# Altium project PMT_simulator.PrjPCB (part 3 of 3)

## Sheet Supply_DAC.SchDoc: =TopTitle
size 420 x 297 mm; EDA_Number: ARTIQ; Projet: Zotino; CheckedBy: -; Author: G.Kasprowicz; CompanyName: WUT ISE; DrawnBy: G.Kasprowicz; Organization: WUT ISE; Address1: PW ISE; Address2: Nowowiejska 15/19 00-665 Warsaw; Address3: gkasprow@gmail.com; Revision: 1.0.1; SheetNumber: -; SheetTotal: -; ModifiedBy: -; CheckedDate: -; Title2: Supply DAC; DivGrp: WUT ISE; Designer: G.Kasprowicz; ModifiedDate: -; ProjectName: Sensor Box
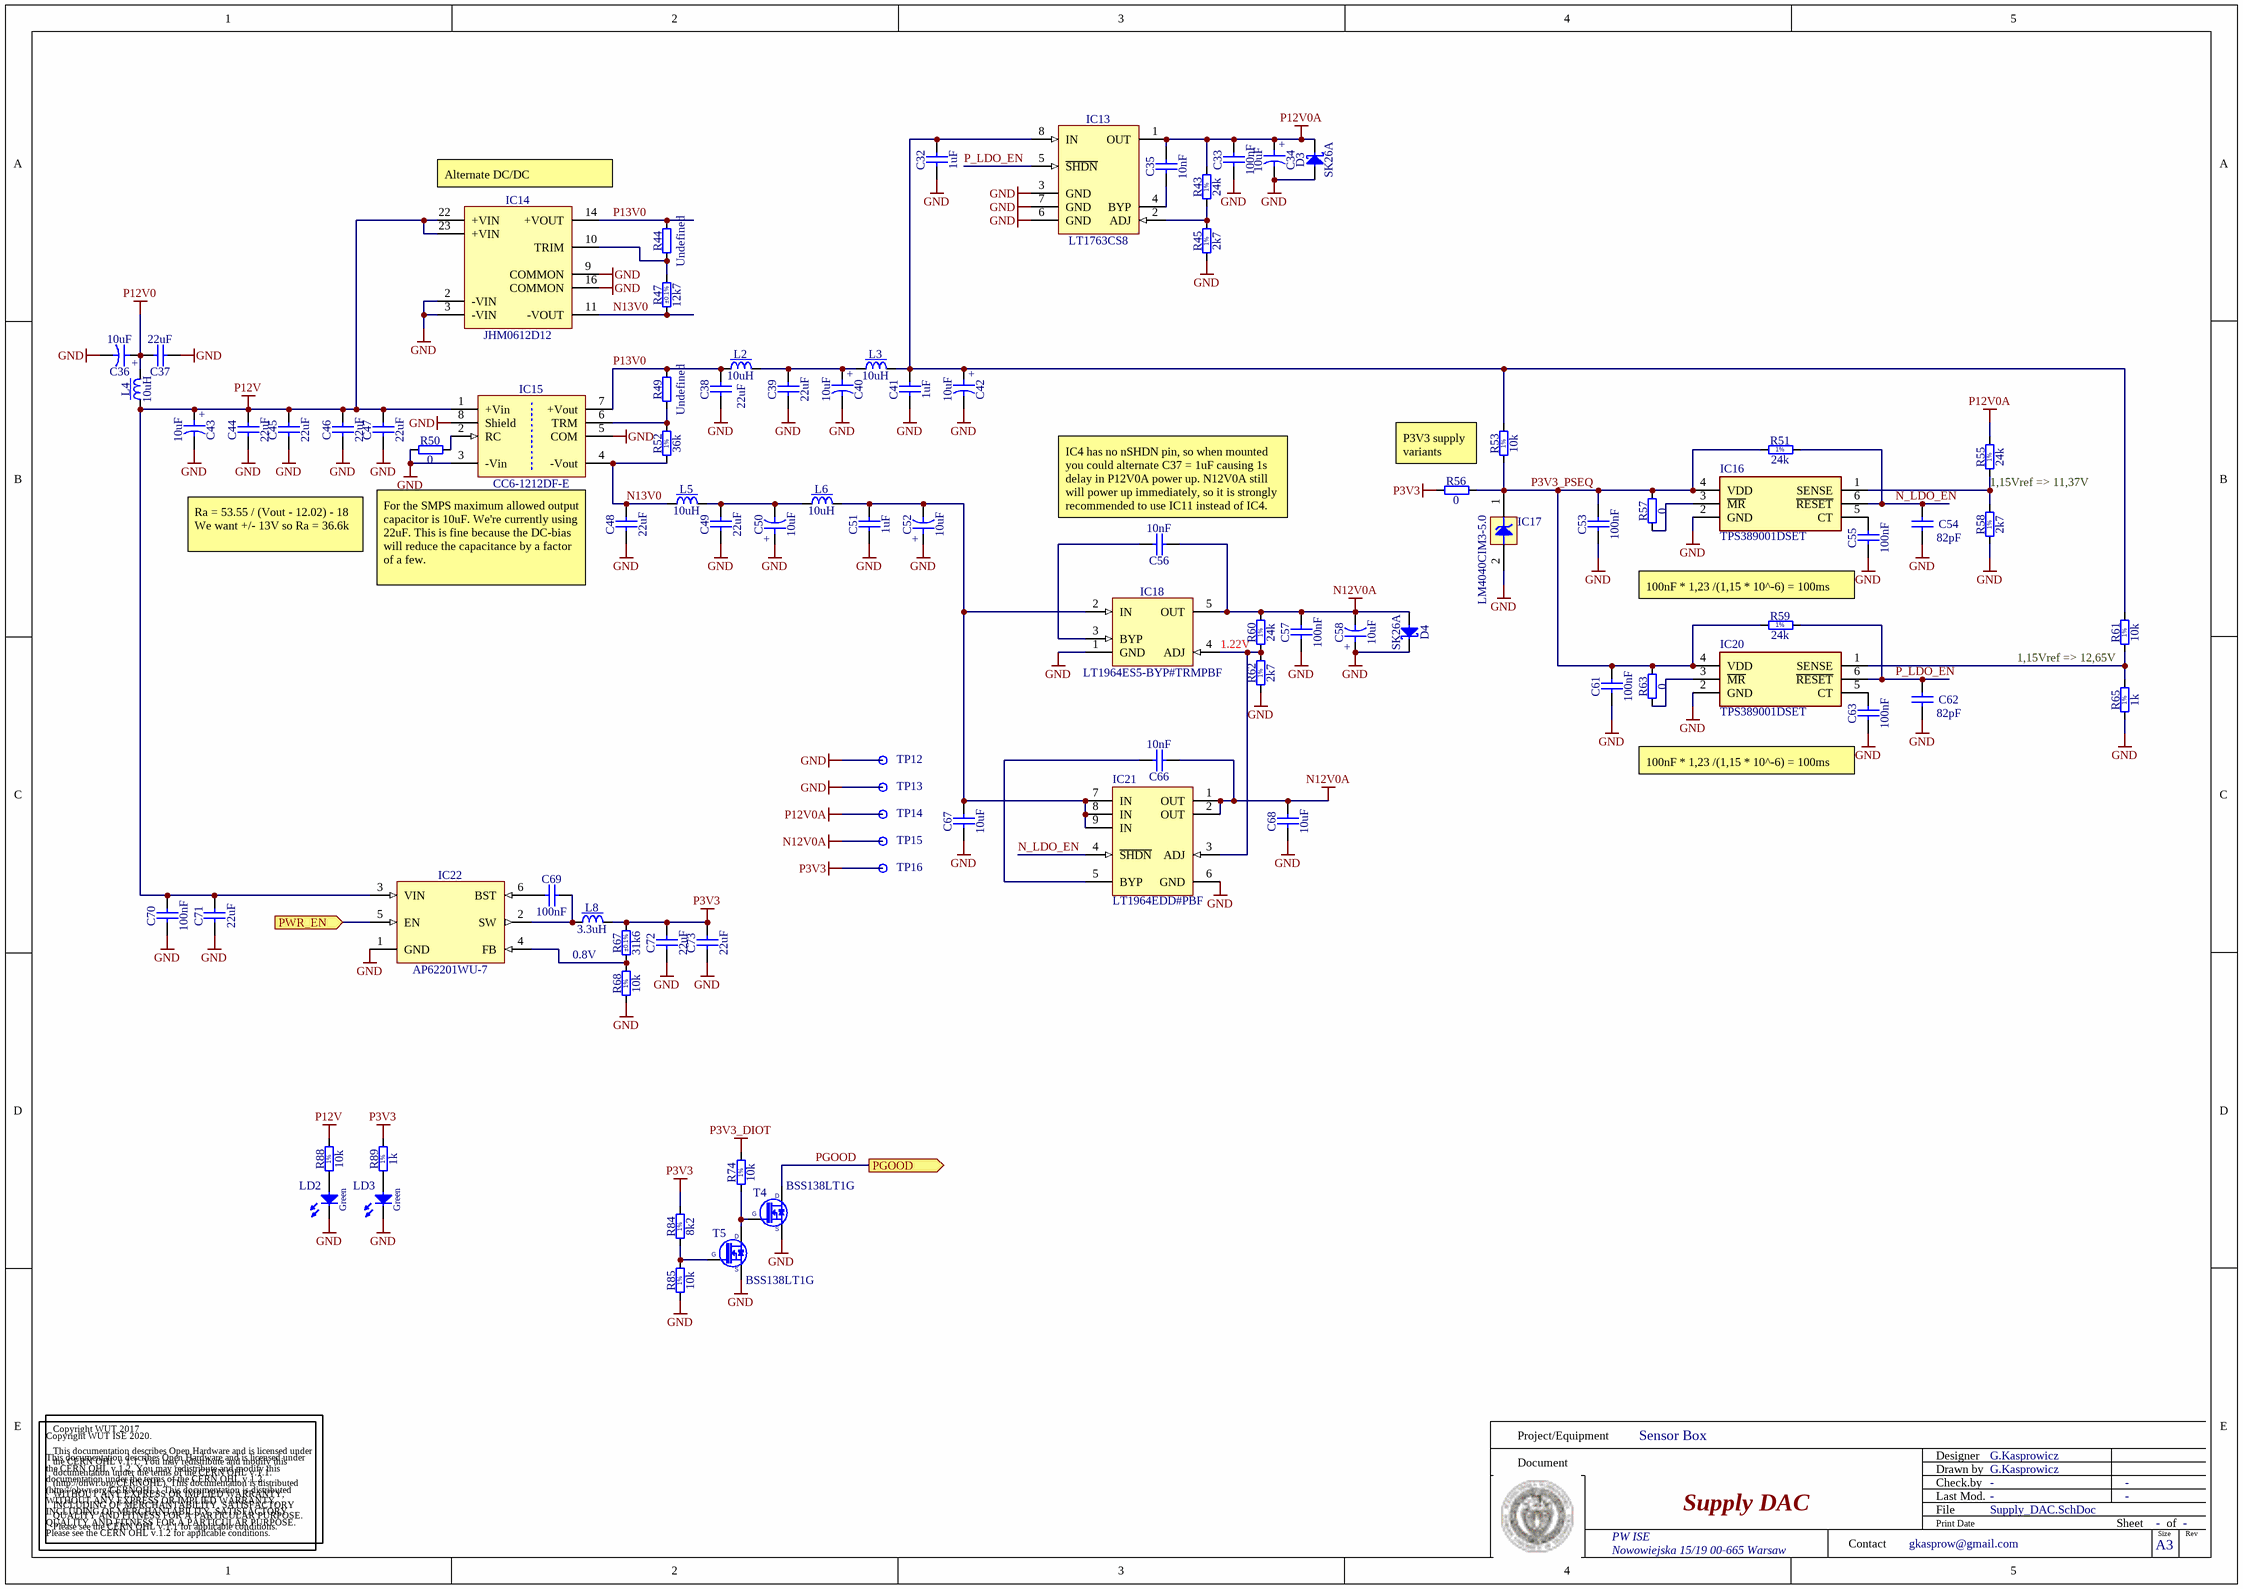
[diagram p6: Supply_DAC.SchDoc]

### Parts
C32  1uF  [CAPC1608X87N]
C33  100nF  [CAPC1005X55N]
C34  10uF  [CAPMP3216X180N]
C35  10nF  [CAPC1608X87N]
C36  10uF  [CAPMP3216X180N]
C37  22uF  [CAPC2012X135N]
C38  22uF  [CAPC2012X135N]
C39  22uF  [CAPC2012X135N]
C40  10uF  [CAPMP3216X180N]
C41  1uF  [CAPC1608X87N]
C42  10uF  [CAPMP3216X180N]
C43  10uF  [CAPMP3216X180N]
C44  22uF  [CAPC2012X135N]
C45  22uF  [CAPC2012X135N]
C46  22uF  [CAPC2012X135N]
C47  22uF  [CAPC2012X135N]
C48  22uF  [CAPC2012X135N]
C49  22uF  [CAPC2012X135N]
C50  10uF  [CAPMP3216X180N]
C51  1uF  [CAPC1608X87N]
C52  10uF  [CAPMP3216X180N]
C53  100nF  [CAPC1005X55N]
C54  82pF  [CAPC1608X87N]
C55  100nF  [CAPC1005X55N]
C56  10nF  [CAPC1608X87N]
C57  100nF  [CAPC1005X55N]
C58  10uF  [CAPMP3216X180N]
C61  100nF  [CAPC1005X55N]
C62  82pF  [CAPC1608X87N]
C63  100nF  [CAPC1005X55N]
C66  10nF  [CAPC1608X87N]
C67  10uF  [CAPC1608X80N]
C68  10uF  [CAPC1608X80N]
C69  100nF  [CAPC1005X55N]
C70  100nF  [CAPC1005X55N]
C71  22uF  [CAPC2012X135N]
C72  22uF  [CAPC2012X135N]
C73  22uF  [CAPC2012X135N]
D3  SK26A  [DIOM5126X265N]
D4  SK26A  [DIOM5126X265N]
IC13  LT1763CS8  [SOIC127P600X175-8N]
IC14  JHM0612D12  [DCDC_XPPOWER_JHM0X]
IC15  CC6-1212DF-E  [CC6-1212DF-E]
IC16  TPS389001DSET  [TPS610985DSET]
IC17  LM4040CIM3-5.0  [SOT95P237X112-3N]
IC18  LT1964ES5-BYP#TRMPBF  [SOT95P280X100-5N]
IC20  TPS389001DSET  [TPS610985DSET]
IC21  LT1964EDD#PBF  [LT-DD-8_V]
IC22  AP62201WU-7  [SOT95P280X100-6N]
L2  10uH  [IND_MURATA-PS_8400]
L3  10uH  [IND_MURATA-PS_8400]
L4  10uH  [IND_MURATA-PS_8400]
L5  10uH  [IND_MURATA-PS_8400]
L6  10uH  [IND_MURATA-PS_8400]
L8  3.3uH  [IND_WURTH_WE-TPC_4828]
LD2  Green  [LED_KINGBRIGHT_KPH-1608CGCK]
LD3  Green  [LED_KINGBRIGHT_KPH-1608CGCK]
R43  24k  [RESC1608X55N]
R44  Undefined  [RESC1608X55N]
R45  2k7  [RESC1608X55N]
R47  12k7  Tolerance: ±0.1%  [RESC1608X55N]
R49  Undefined  [RESC1608X55N]
R50  0  [RESC1005X40N]
R51  24k  [RESC1608X55N]
R52  36k  [RESC1608X55N]
R53  10k  [RESC1005X40N]
R55  24k  [RESC1608X55N]
R56  0  [RESC1005X40N]
R57  0  [RESC1005X40N]
R58  2k7  [RESC1608X55N]
R59  24k  [RESC1608X55N]
R60  24k  [RESC1608X55N]
R61  10k  [RESC1005X40N]
R62  2k7  [RESC1608X55N]
R63  0  [RESC1005X40N]
R65  1k  [RESC1608X55N]
R67  31k6  Tolerance: ±0.1%  [RESC1005X35N]
R68  10k  [RESC1005X40N]
R74  10k  [RESC1005X40N]
R84  8k2  [RESC1005X40N]
R85  10k  [RESC1005X40N]
R88  10k  [RESC1005X40N]
R89  1k  [RESC1005X40N]
T4  BSS138LT1G  [SOT95P240X110-3N]
T5  BSS138LT1G  [SOT95P240X110-3N]
TP12  Test Point  [TPS127]  (value not drawn)  (no BOM)
TP13  Test Point  [TPS127]  (value not drawn)  (no BOM)
TP14  Test Point  [TPS127]  (value not drawn)  (no BOM)
TP15  Test Point  [TPS127]  (value not drawn)  (no BOM)
TP16  Test Point  [TPS127]  (value not drawn)  (no BOM)

### Ports
PGOOD (out), PWR_EN (in)

### Nets
GND: C32.1 C33.1 C34.2 C36.2 C37.1 C38.1 C39.1 C40.2 C41.1 C42.2 C43.2 C44.1 C45.1 C46.1 C47.1 C48.1 C49.1 C50.1 C51.1 C52.1 C53.1 C54.1 C55.1 C57.1 C58.1 C61.1 C62.1 C63.1 C67.1 C68.1 C70.1 C71.1 C72.1 C73.1 D3.2(A) D4.1(C) IC13.3(GND) IC13.6(GND) IC13.7(GND) IC14.2(-VIN) IC14.3(-VIN) IC14.9(COMMON) IC14.16(COMMON) IC15.3(-Vin) IC15.5(COM) IC15.8(Shield) IC16.2(GND) IC17.2(A) IC18.1(GND) IC20.2(GND) IC21.6(GND) IC22.1(GND) LD2.1(C) LD3.1(C) R45.1 R50.1 R58.1 R62.1 R65.1 R68.1 R85.1 T4.2(S) T5.2(S) TP12.1 TP13.1
N12V0A: C56.1 C57.2 C58.2 C66.1 C68.2 D4.2(A) IC18.5(OUT) IC21.1(OUT) IC21.2(OUT) R60.2 TP15.1
P3V3: C72.2 C73.2 L8.2 R56.1 R67.2 R84.2 R89.2 TP16.1
P3V3_DIOT: R74.2
P12V: C43.1 C44.2 C45.2 C46.2 C47.2 C70.2 C71.2 IC14.22(+VIN) IC14.23(+VIN) IC15.1(+Vin) IC22.3(VIN) L4.1 R88.2
P12V0: C36.1 C37.2 L4.2
P12V0A: C33.2 C34.1 C35.2 D3.1(C) IC13.1(OUT) R43.2 R55.2 TP14.1
N13V0: C48.2 IC14.11(-VOUT) IC15.4(-Vout) L5.1 R47.1 R52.1
N_LDO_EN: C54.2 IC16.6(~{RESET}) IC21.4(~{SHDN}) R51.2
P3V3_PSEQ: C53.2 C61.2 IC16.4(VDD) IC17.1(C) IC20.4(VDD) R51.1 R53.1 R56.2 R57.2 R59.1 R63.2
P13V0: C38.2 IC14.14(+VOUT) IC15.7(+Vout) L2.1 R44.2 R49.2
P_LDO_EN: C62.2 IC13.5(~{SHDN}) IC20.6(~{RESET}) R59.2
PGOOD: T4.3(D) ; port PGOOD
NetC32_2: C32.2 C41.2 C42.1 IC13.8(IN) L3.2 R53.2 R61.2
NetC35_1: C35.1 IC13.4(BYP)
NetC39_2: C39.2 C40.1 L2.2 L3.1
NetC49_2: C49.2 C50.2 L5.2 L6.1
NetC51_2: C51.2 C52.2 C67.2 IC18.2(IN) IC21.7(IN) IC21.8(IN) IC21.9(IN) L6.2
NetC55_2: C55.2 IC16.5(CT)
NetC56_2: C56.2 IC18.3(BYP)
NetC63_2: C63.2 IC20.5(CT)
NetC66_2: C66.2 IC21.5(BYP)
NetC69_1: C69.1 IC22.6(BST)
NetC69_2: C69.2 IC22.2(SW) L8.1
NetIC13_2: IC13.2(ADJ) R43.1 R45.2
NetIC14_10: IC14.10(TRIM) R44.1 R47.2
NetIC15_2: IC15.2(RC) R50.2
NetIC15_6: IC15.6(TRM) R49.1 R52.2
NetIC16_1: IC16.1(SENSE) R55.1 R58.2
NetIC16_3: IC16.3(~{MR}) R57.1
NetIC18_4: IC18.4(ADJ) IC21.3(ADJ) R60.1 R62.2
NetIC20_1: IC20.1(SENSE) R61.1 R65.2
NetIC20_3: IC20.3(~{MR}) R63.1
NetIC22_4: IC22.4(FB) R67.1 R68.2
NetIC22_5: IC22.5(EN) ; port PWR_EN
NetLD2_2: LD2.2(A) R88.1
NetLD3_2: LD3.2(A) R89.1
NetR74_1: R74.1 T4.1(G) T5.3(D)
NetR84_1: R84.1 R85.2 T5.1(G)

### Notes on the sheet
- (near IC14) Alternate DC/DC
  Trim +10%, R27=12.8k
- P3V3 supply
  variants
- (near C56) IC4 has no nSHDN pin, so when mounted you could alternate C37 = 1uF causing 1s delay in P12V0A power up. N12V0A still will power up immediately, so it is strongly recommended to use IC11 instead of IC4.
- (near R55) 1,15Vref => 11,37V
- Ra = 53.55 / (Vout - 12.02) - 18
  We want +/- 13V so Ra = 36.6k
- For the SMPS maximum allowed output capacitor is 10uF. We're currently using 22uF. This is fine because the DC-bias will reduce the capacitance by a factor of a few.
- 100nF * 1,23 /(1,15 * 10^-6) = 100ms
- 1.22V
- (near R61) 1,15Vref => 12,65V
- 0.8V
- Copyright WUT 2017
  This documentation describes Open Hardware and is licensed under the CERN OHL v.1.1. You may redistribute and modify this documentation under the terms of the CERN OHL v.1.1. (http://ohwr.org/CERNOHL). This documentation is distributed WITHOUT ANY EXPRESS OR IMPLIED WARRANTY, INCLUDING OF MERCHANTABILITY, SATISFACTORY QUALITY AND FITNESS FOR A PARTICULAR PURPOSE. Please see the CERN OHL v.1.1 for applicable conditions.
- Project/Equipment
- Document
- Designer
- Drawn by
- Check.by
- Copyright WUT ISE 2020.
  This documentation describes Open Hardware and is licensed under the CERN OHL v.1.2. You may redistribute and modify this documentation under the terms of the CERN OHL v.1.2. (http://ohwr.org/CERNOHL). This documentation is distributed WITHOUT ANY EXPRESS OR IMPLIED WARRANTY, INCLUDING OF MERCHANTABILITY, SATISFACTORY QUALITY AND FITNESS FOR A PARTICULAR PURPOSE. Please see the CERN OHL v.1.2 for applicable conditions.
- Contact
- File
- Last Mod.
- Print Date
- Sheet
- Size
- A3
- of
- Rev
- (in symbol CTE3216-18_10UF_16V_20%_AVX_TCJ) +
- (in symbol R0402_1K_1%_0.0625W_100PPM) 1%
- (in symbol R0402_8K2_1%_0.0625W_100PPM) 1%
- (in symbol R0402_10K_1%_0.0625W_100PPM) 1%
- (in symbol R0603_1K_1%_0.1W_100PPM) 1%
- (in symbol R0603_2K7_1%_0.1W_100PPM) 1%
- (in symbol R0603_24K_1%_0.1W_100PPM) 1%
- (in symbol R0603_36K_1%_0.1W_100PPM) 1%

### Library data of the parts
C32 C41 C51 = CC0603_1UF_25V_10%_X7R: Non-polarised capacitor; Part Description: SMD Multilayer Chip Ceramic Capacitor; Manufacturer: GENERIC; Manufacturer1 Part Number: GRM188R71E105KA12D; Voltage: 25V; TC: X7R; Tolerance: ±10%; Part Number: CC0603_1UF_25V_10%_X7R; Component Kind: Standard; Component Type: Standard; Pin Count: 2; Value: 1uF; Status: None; Manufacturer Part Number: CC0603_1UF_25V_10%_X7R; Case: 0603; Mounted: Yes; Socket: No; SMD: Yes; Sense: No; Manufacturer1 Example: MURATA; Manufacturer1 ComponentHeight: 0.9mm; HelpURL: \\cern.ch\dfs\Applications\Altium\Datasheets\CC0603_X7R_MURATA.pdf; Author: CERN DEM JLC; CreateDate: 18.01.2011; LatestRevisionDate: 18.01.2011
C33 C53 C55 C57 C61 C63 C69 C70 = CC0402_100NF_16V_10%_X5R: Non-polarised capacitor; Part Description: SMD Multilayer Chip Ceramic Capacitor; Manufacturer: GENERIC; Manufacturer1 Part Number: GRM155R61C104KA88D; Voltage: 16V; TC: X5R; Tolerance: ±10%; Part Number: CC0402_100NF_16V_10%_X5R; Component Kind: Standard; Component Type: Standard; Pin Count: 2; Value: 100nF; Status: None; Manufacturer Part Number: CC0402_100NF_16V_10%_X5R; Case: 0402; Mounted: Yes; Socket: No; SMD: Yes; Sense: No; Manufacturer1 Example: MURATA; Manufacturer1 ComponentHeight: 0.55mm; HelpURL: \\cern.ch\dfs\Applications\Altium\Datasheets\CC0402_X5R_MURATA_GRM.pdf; Author: CERN DEM JLC; CreateDate: 10.12.2013; LatestRevisionDate: 10.12.2013
C34 C36 C40 C42 C43 C50 C52 C58 = CTE3216-18_10UF_16V_20%_AVX_TCJ: Polarised capacitor; Part Description: ESR 0R200 Tantalum Solid Electrolytic Chip Capacitor with Conductive Polymer Electrode; Manufacturer: AVX; Manufacturer Part Number: TCJA106M016R0200; Voltage: 16V; Tolerance: ±20%; Part Number: CTE3216-18_10UF_16V_20%_AVX_TCJ; Component Kind: Standard; Component Type: Standard; Pin Count: 2; Value: 10uF; Status: Preferred; Case: A; Mounted: Yes; Socket: No; SMD: Yes; Sense: No; ComponentHeight: 1.8mm; HelpURL: \\cern.ch\dfs\Applications\Altium\Datasheets\CTE_AVX_TCJ.pdf; Author: CERN DEM JLC; CreateDate: 29.03.2012; LatestRevisionDate: 29.03.2012
C35 C56 C66 = CC0603_10NF_50V_10%_X7R: Non-polarised capacitor; Part Description: SMD Multilayer Chip Ceramic Capacitor; Manufacturer: GENERIC; Manufacturer1 Part Number: 223858615636; Voltage: 50V; TC: X7R; Tolerance: ±10%; Part Number: CC0603_10NF_50V_10%_X7R; Component Kind: Standard; Component Type: Standard; Pin Count: 2; Value: 10nF; Status: Preferred; Manufacturer Part Number: CC0603_10NF_50V_10%_X7R; Case: 0603; Mounted: Yes; Socket: No; SMD: Yes; Sense: No; Manufacturer1 Example: PHYCOMP; Manufacturer1 ComponentHeight: 0.87mm; HelpURL: \\cern.ch\dfs\Applications\Altium\Datasheets\CC0603_X7R_PHYCOMP.pdf; Author: CERN DEM JLC; CreateDate: 03.12.2007; LatestRevisionDate: 03.12.2007
C37-C39 C44-C49 C71-C73 = CC0805_22UF_16V_10%_X5R: Non-polarised capacitor; Part Description: SMD Multilayer Chip Ceramic Capacitor; Manufacturer: GENERIC; Manufacturer1 Part Number: C2012X5R1C226KT; Voltage: 16V; TC: X5R; Tolerance: ±10%; Part Number: CC0805_22UF_16V_10%_X5R; Component Kind: Standard; Component Type: Standard; Pin Count: 2; Value: 22uF; Status: Preferred; Manufacturer Part Number: CC0805_22UF_16V_10%_X5R; Case: 0805; Mounted: Yes; Socket: No; SMD: Yes; Sense: No; Manufacturer1 Example: TDK; Manufacturer1 ComponentHeight: 1.35mm; HelpURL: \\cern.ch\dfs\Applications\Altium\Datasheets\CC0805_X5R_TDK_C.pdf; Author: CERN DEM JLC; CreateDate: 25.10.2012; LatestRevisionDate: 25.10.2012
C54 C62 = CC0603_82PF_50V_5%_NP0: Non-polarised capacitor; Part Description: SMD Multilayer Chip Ceramic Capacitor; Manufacturer: GENERIC; Manufacturer1 Part Number: 223886715829; Voltage: 50V; TC: C0G/NP0; Tolerance: ±5%; Part Number: CC0603_82PF_50V_5%_NP0; Component Kind: Standard; Component Type: Standard; Pin Count: 2; Value: 82pF; Status: Preferred; Manufacturer Part Number: CC0603_82PF_50V_5%_NP0; Case: 0603; Mounted: Yes; Socket: No; SMD: Yes; Sense: No; Manufacturer1 Example: PHYCOMP; Manufacturer1 ComponentHeight: 0.87mm; HelpURL: \\cern.ch\dfs\Applications\Altium\Datasheets\CC0603_NP0_PHYCOMP.pdf; Author: CERN DEM JLC; CreateDate: 03.12.2007; LatestRevisionDate: 03.12.2007
C67 C68 = CC0603_10UF_16V_20%_X5R: Non-polarised capacitor; Part Description: SMD Multilayer Chip Ceramic Capacitor; Manufacturer: GENERIC; Manufacturer1 Part Number: GRM188R61C106MA73D; Voltage: 16V; TC: X5R; Tolerance: ±20%; Part Number: CC0603_10UF_16V_20%_X5R; Component Kind: Standard; Component Type: Standard; Pin Count: 2; Value: 10uF; Status: None; Manufacturer Part Number: CC0603_10UF_16V_20%_X5R; Case: 0603; Mounted: Yes; Socket: No; SMD: Yes; Sense: No; Manufacturer1 Example: MURATA; Manufacturer1 ComponentHeight: 0.8mm; HelpURL: \\cern.ch\dfs\Applications\Altium\Datasheets\CC0603_X5R_MURATA_GRM.pdf; Author: CERN DEM MR; CreateDate: 02.03.2016; LatestRevisionDate: 02.03.2016
D3 D4 = SK26A: Schottky Diode; Part Description: 2A, 60V Surface Mount Schottky Barrier Rectifier; Manufacturer: TAIWAN SEMICONDUCTOR; Voltage: 60V; Power: 2A; PressFit: No; Bonding: No; Part Number: SK26A; Component Kind: Standard; Component Type: Standard; Device: SK26A; PackageDescription: DO-214-AC/SMA Molded Diode, 2-Leads, Body 5.1x2.6mm, IPC Medium Density; Manufacturer Part Number: SK26A; Pin Count: 2; Case: DO-214AC; Mounted: Yes; Socket: No; SMD: Yes; Sense: No; ComponentHeight: 2.5mm; HelpURL: \\cern.ch\dfs\Applications\Altium\Datasheets\SK26A.pdf; Author: CERN DEM JMW; CreateDate: 07.08.2015; LatestRevisionDate: 07.08.2015
IC13 = LT1763CS8: 1.22V to 20V 500mA, Low Noise, LDO Adjustable Micropower Regulator; Part Description: 1.22V to 20V, 500mA, Low Noise, LDO Adjustable Micropower Regulator; Manufacturer: LINEAR TECHNOLOGY; PressFit: No; Bonding: No; Part Number: LT1763CS8; Component Kind: Standard; Component Type: Standard; Device: LT1763CS8; PackageDescription: SOIC 8, Pitch 1.27mm, Body 4x5mm, IPC Medium Density; Manufacturer Part Number: LT1763CS8; Pin Count: 8; Case: SOIC8; Mounted: Yes; Socket: No; SMD: Yes; Sense: No; ComponentHeight: 1.75mm; HelpURL: \\cern.ch\dfs\Applications\Altium\Datasheets\LT1763CS8#PBF.pdf; Author: CERN DEM JLC; CreateDate: 11.01.2010; LatestRevisionDate: 16.03.2021
IC14 = JHM0612D12: 9-72VDC to 3.3-15VDC, Iout (max) 500mA, DC-DC Converter; Part Description: 10-17V to  ±12V ( ±250mA)  Power Supply; Manufacturer: XP POWER; PressFit: No; Bonding: No; Part Number: JHM0612D12; Component Kind: Standard; Component Type: Standard; Device: JHM0612D12; PackageDescription: JHM Series , Body 31.75 x 20.32mm; Status: None; Manufacturer Part Number: JHM0612D12; Pin Count: 9; Mounted: Yes; Socket: No; SMD: No; Sense: No; ComponentHeight: 10.4mm; HelpURL: \\cern.ch\dfs\Applications\Altium\Datasheets\JHM0X.pdf; Author: CERN DEM HF; CreateDate: 12.07.2022; LatestRevisionDate: 12.07.2022
IC15 = DC/DC_CC6-1212DF-E: CONV DC/DC 6W DUAL 12V +-12V PCB; Manufacturer: TDK-Lambda Americas Inc.; PressFit: No; Bonding: No; Part Number: CC6-1212DF-E; Component Kind: Standard; Component Type: Standard; Device: CC6-1212DF-E; PackageDescription: CC6 Series, Body 0.900 x 0.831 x 0.335, Regulated; Part Description: CONV DC/DC 6W DUAL 12V +-12V PCB; Manufacturer Part Number: CC6-1212DF-E; Pin Count: 7; Mounted: Yes; Socket: No; SMD: No; Sense: No; ComponentHeight: 10.45mm; Author: GK; CreateDate: 17.12.2016; LatestRevisionDate: 17.12.2016
IC16 IC20 = TPS389001DSET: Supervisory Circuits Low-quiescent current 1% accuracy supervisor with programmable delay; Manufacturer_Name: Texas Instruments; Datasheet Link: https://www.ti.com/general/docs/suppproductinfo.tsp?distId=10&gotoUrl=https%3A%2F%2Fwww.ti.com%2Flit%2Fgpn%2Ftps3890; Height: 0.8mm; Manufacturer Part Number: TPS389001DSET; Mouser Part Number: 595-TPS389001DSET; Mouser Price/Stock: https://www.mouser.co.uk/ProductDetail/Texas-Instruments/TPS389001DSET?qs=dSktwyqbRaUv%2FgF0PRoIcw%3D%3D
IC17 = LM4040CIM3-5.0: Integrated Circuit; Manufacturer_Name: Texas Instruments; Datasheet Link: http://www.ti.com/lit/ds/symlink/lm4040-n.pdf; Height: 1.12mm; Manufacturer Part Number: LM4040CIM3-5.0; Mouser Part Number: 926-LM4040CIM3-50; Mouser Price/Stock: https://www.mouser.co.uk/ProductDetail/Texas-Instruments/LM4040CIM3-50?qs=QbsRYf82W3GkYEk3maEP0Q%3D%3D; Arrow Part Number: LM4040CIM3-5.0; Arrow Price/Stock: https://www.arrow.com/en/products/lm4040cim3-5.0/texas-instruments?region=nac
IC18 = LT1964ES5-BYP#TRMPBF: 200mA, Low Noise, Low Dropout Negative Micropower Regulator; Part Description: -1.22V to -20V, 200mA, Low Noise, Low Dropout Negative Micropower Regulator; Manufacturer: LINEAR TECHNOLOGY; PressFit: No; Bonding: No; Part Number: LT1964ES5-BYP#TRMPBF; Component Kind: Standard; Component Type: Standard; Device: LT1964ES5-BYP#TRMPBF; PackageDescription: SOT23, 0.95mm pitch; 5 pin, 1.75mm W X 3.00mm L, IPC Medium Density; Manufacturer Part Number: LT1964ES5-BYP#TRMPBF; Pin Count: 5; Case: SOT23-5; Mounted: Yes; Socket: No; SMD: Yes; Sense: No; ComponentHeight: 1mm; HelpURL: \\cern.ch\dfs\Applications\Altium\Datasheets\LT1964ES5-BYP#TRMPBF.pdf; Author: CERN DEM MR; CreateDate: 17.02.2016; LatestRevisionDate: 17.02.2016
IC21 = CMP-0476-00219-1: 200 mA, Low Noise, Low Dropout Negative Micropower Regulator, -1.9 to -20 V Vin, Adjustable Vout, 8-pin SON (DD-8), -40 to 125 degC, Pb-Free; Manufacturer: Linear Technology; Output Voltage: Adj; Isupply(mA): 0.03; Dropout Voltage(V): 0.34; Vout Max(V): -1.22; Shutdown Current(uA): 3; Noise(uV): 30; Discrete Pass Element: no; Iout(mA): 200; Number of Outputs: 1; PSRR(dB): 54; ComponentLink3Description: Package Specification; PackageDescription: 8-Pin Plastic DFN, Body 3 x 3 mm, Pitch 0.5 mm; RoHS: TRUE; ComponentLink1Description: Manufacturer URL; Vin Max(V): -1.9; Vout Min(V): -20; Code_JEDEC: MO-229; ComponentLink1URL: http://www.linear.com/; PartNumber: LT1964EDD#PBF; PackageVersion: Jun-10; DatasheetVersion: Rev. B; PackageReference: DD-8; ComponentLink2Description: Datasheet; Vin Min(V): -20; ComponentLink3URL: http://cds.linear.com/docs/en/packaging/DFN_8_05-08-1698.pdf; ComponentLink2URL: http://cds.linear.com/docs/en/datasheet/1964fb.pdf; Mounting Technology: Surface Mount
IC22 = AP62201WU-7: 4.2V TO 18V INPUT, 2A LOW IQ SYNCHRONOUS BUCK CONVERTER; Manufacturer: DIODES INCORPORATED; PressFit: No; Bonding: No; Part Number: AP62201WU-7; Component Kind: Standard; Component Type: Standard; Device: AP62201WU-7; PackageDescription: SOT23, 0.95mm Pitch; 6 Pin, 1.625mm W X 2.90mm L X 1.00mm H body, IPC Medium Density; Part Description: 4.2V To 18V Input, 2A Low Iq Synchronous Buck Converter; Manufacturer Part Number: AP62201WU; Pin Count: 6; Case: SOT23-6; Mounted: Yes; Socket: No; SMD: Yes; Sense: No; ComponentHeight: 1.1mm; HelpURL: \\cern.ch\dfs\Applications\Altium\Datasheets\AP6220x.pdf; Author: CERN DEM HF; CreateDate: 07.01.2022; LatestRevisionDate: 21.03.2022
L2-L6 = IND_10UH_10%_MURATA-PS_8400: Inductor With Core; Part Description: Miniature Surface Mount Power Inductor (8400 Serie); Manufacturer: MURATA POWER SOLUTIONS; Manufacturer Part Number: 84103C; Power: 950mA; Resistance: 0.24R; Tolerance: ±10%; Part Number: IND_10UH_10%_MURATA-PS_8400; Component Kind: Standard; Component Type: Standard; Pin Count: 2; Value: 10uH; Status: None; Mounted: Yes; Socket: No; SMD: Yes; Sense: No; ComponentHeight: 2.9mm; HelpURL: \\cern.ch\dfs\Applications\Altium\Datasheets\IND_MURATA-PS_8400.pdf; Author: CERN DEM JLC; CreateDate: 02.07.2012; LatestRevisionDate: 02.07.2012
L8 = IND_3.3UH_30%_WURTH_WE-TPC_744043003: Inductor With Core; Part Description: Shielded Tiny Power Inductor (WE-TPC Serie); Manufacturer: WURTH ELEKTRONIK; Power: 2.15A; Resistance: 0.03R; Tolerance: ±30%; Part Number: IND_3.3UH_30%_WURTH_WE-TPC_744043003; Component Kind: Standard; Component Type: Standard; Pin Count: 2; Value: 3.3uH; Manufacturer Part Number: 744043003; Mounted: Yes; Socket: No; SMD: Yes; Sense: No; ComponentHeight: 3mm; HelpURL: \\cern.ch\dfs\Applications\Altium\Datasheets\IND_WURTH_WE-TPC_744043003.pdf; Author: CERN DEM JLC; CreateDate: 12.07.2011; LatestRevisionDate: 24.01.2012
LD2 LD3 = LED_KINGBRIGHT_KPH-1608CGCK: LED Green 1C 2A; Part Description: SMD Green LED, Case 1.6mmX0.8mm(0603), 0.65mm Thickness; PressFit: No; Bonding: No; Manufacturer Part Number: KPH-1608CGCK; ComponentHeight: 0.65mm; HelpURL: \\cern.ch\dfs\Applications\Altium\Datasheets\LED_KINGBRIGHT_KPH-1608CGCK.pdf; Part Number: LED_KINGBRIGHT_KPH-1608CGCK; Component Kind: Standard; Component Type: Standard; Color: Green; PackageDescription: SMT Green LED, Case 0603, Body L 1.6 x W 0.8mm H 0.65mm; Manufacturer: KINGBRIGHT; Pin Count: 2; Mounted: Yes; Socket: No; SMD: Yes; Sense: No; Author: CERN DEM JLC; CreateDate: 03.07.2017; LatestRevisionDate: 03.07.2017
R43 R51 R55 R59 R60 = R0603_24K_1%_0.1W_100PPM: Resistor - 1%; Part Description: General Purpose Thick Film Chip Resistor; Manufacturer: GENERIC; Manufacturer1 Part Number: NRC06F2402TRF; Power: 0.1W; TC: ±100ppm/°C; Part Number: R0603_24K_1%_0.1W_100PPM; Component Kind: Standard; Component Type: Standard; Pin Count: 2; Value: 24k; Status: Preferred; Tolerance: ±1%; Manufacturer Part Number: R0603_24K_1%_0.1W_100PPM; Case: 0603; Mounted: Yes; Sense: No; Socket: No; SMD: Yes; Manufacturer1 Example: NIC COMPONENT; Manufacturer1 ComponentHeight: 0.55mm; HelpURL: \\cern.ch\dfs\Applications\Altium\Datasheets\R0603_NIC_NRC.pdf; Author: CERN DEM JLC; CreateDate: 03.12.2007; LatestRevisionDate: 13.03.2008
R44 R49 = R0603_NO-VALUE: Resistor; Part Description: Reserved Footprint For a 0603 (1608) Chip Resistor; Mounted: No; Part Number: R0603_NO-VALUE; Component Kind: Standard; Component Type: Standard; Pin Count: 2; Value: Undefined; Status: None; Manufacturer: Undefined; Manufacturer Part Number: R0603_NO-VALUE; Case: 0603; Sense: No; Socket: No; SMD: Yes; Manufacturer1 Example: Undefined; Manufacturer1 Part Number: Undefined; Manufacturer1 ComponentHeight: Undefined; HelpURL: Undefined; Author: CERN DEM JLC; CreateDate: 03.12.2007; LatestRevisionDate: 13.03.2008
R45 R58 R62 = R0603_2K7_1%_0.1W_100PPM: Resistor - 1%; Part Description: General Purpose Thick Film Chip Resistor; Manufacturer: GENERIC; Manufacturer1 Part Number: RC0603FR-072K7L; Power: 0.1W; TC: ±100ppm/°C; Part Number: R0603_2K7_1%_0.1W_100PPM; Component Kind: Standard; Component Type: Standard; Pin Count: 2; Value: 2k7; Status: Preferred; Tolerance: ±1%; Manufacturer Part Number: R0603_2K7_1%_0.1W_100PPM; Case: 0603; Mounted: Yes; Sense: No; Socket: No; SMD: Yes; Manufacturer1 Example: YAGEO PHYCOMP; Manufacturer1 ComponentHeight: 0.55mm; HelpURL: \\cern.ch\dfs\Applications\Altium\Datasheets\R0603_PHYCOMP_RC0603.pdf; Author: CERN DEM JLC; CreateDate: 02.05.2011; LatestRevisionDate: 02.05.2011
R47 = R0603_12K7_0.1%_0.063W_10PPM: Resistor - 0.1%; Part Description: Thin Film Chip Resistor; Manufacturer: GENERIC; Manufacturer1 Part Number: RN73C1J12K7BTDF; Power: 0.063W; TC: ±10ppm; PressFit: No; Part Number: R0603_12K7_0.1%_0.063W_10PPM; Component Kind: Standard; Component Type: Standard; Pin Count: 2; Value: 12k7; Status: Not Recommended; Manufacturer Part Number: R0603_12K7_0.1%_0.063W_10PPM; Case: 0603; Mounted: Yes; Sense: No; Socket: No; SMD: Yes; Manufacturer1 Example: TYCO HOLSWORTHY; Manufacturer1 ComponentHeight: 0.5mm; HelpURL: \\cern.ch\dfs\Applications\Altium\Datasheets\R0603_Tyco_RN73.pdf; Author: CERN DEM JLC; CreateDate: 03.12.2007; LatestRevisionDate: 13.03.2008
R50 R56 R57 R63 = R0402_0R_JUMPER: Resistor; Part Description: 1A (0.05R Max DC Resistance) Zero Ohm Jumper; Manufacturer: GENERIC; Manufacturer1 Part Number: 232270591001L; Part Number: R0402_0R_JUMPER; Component Kind: Standard; Component Type: Standard; Pin Count: 2; Value: 0; Status: Not recommended; Manufacturer Part Number: R0402_0R_JUMPER; Case: 0402; Mounted: Yes; Sense: No; Socket: No; SMD: Yes; Manufacturer1 Example: YAGEO PHYCOMP; Manufacturer1 ComponentHeight: 0.4mm; HelpURL: \\cern.ch\dfs\Applications\Altium\Datasheets\R0402_Phycomp_RC0402.pdf; Author: CERN DEM JLC; CreateDate: 03.12.2007; LatestRevisionDate: 17.10.2012
R52 = R0603_36K_1%_0.1W_100PPM: Resistor - 1%; Part Description: General Purpose Thick Film Chip Resistor; Manufacturer: GENERIC; Manufacturer1 Part Number: NRC06F3602TRF; Power: 0.1W; TC: ±100ppm/°C; PressFit: No; Part Number: R0603_36K_1%_0.1W_100PPM; Component Kind: Standard; Component Type: Standard; Pin Count: 2; Value: 36k; Status: Preferred; Tolerance: ±1%; Manufacturer Part Number: R0603_36K_1%_0.1W_100PPM; Case: 0603; Mounted: Yes; Sense: No; Socket: No; SMD: Yes; Manufacturer1 Example: NIC COMPONENT; Manufacturer1 ComponentHeight: 0.55mm; HelpURL: \\cern.ch\dfs\Applications\Altium\Datasheets\R0603_NIC_NRC.pdf; Author: CERN DEM JLC; CreateDate: 03.12.2007; LatestRevisionDate: 13.03.2008
R53 R61 R68 R74 R85 R88 = R0402_10K_1%_0.0625W_100PPM: Resistor - 1%; Part Description: General Purpose Thick Film Chip Resistor; Manufacturer: GENERIC; Manufacturer1 Part Number: 232270671003L; TC: ±100ppm/°C; Part Number: R0402_10K_1%_0.0625W_100PPM; Component Kind: Standard; Component Type: Standard; Pin Count: 2; Value: 10k; Status: Not recommended; Power: 0.0625W; Tolerance: ±1%; Manufacturer Part Number: R0402_10K_1%_0.0625W_100PPM; Case: 0402; Mounted: Yes; Sense: No; Socket: No; SMD: Yes; Manufacturer1 Example: YAGEO PHYCOMP; Manufacturer1 ComponentHeight: 0.4mm; HelpURL: \\cern.ch\dfs\Applications\Altium\Datasheets\R0402_Phycomp_RC0402.pdf; Author: CERN DEM JLC; CreateDate: 03.12.2007; LatestRevisionDate: 17.10.2012
R65 = R0603_1K_1%_0.1W_100PPM: Resistor - 1%; Part Description: General Purpose Thick Film Chip Resistor; Manufacturer: GENERIC; Manufacturer1 Part Number: NRC06F1001TRF; Power: 0.1W; TC: ±100ppm/°C; PressFit: No; Part Number: R0603_1K_1%_0.1W_100PPM; Component Kind: Standard; Component Type: Standard; Pin Count: 2; Value: 1k; Status: Preferred; Tolerance: ±1%; Manufacturer Part Number: R0603_1K_1%_0.1W_100PPM; Case: 0603; Mounted: Yes; Sense: No; Socket: No; SMD: Yes; Manufacturer1 Example: NIC COMPONENT; Manufacturer1 ComponentHeight: 0.55mm; HelpURL: \\cern.ch\dfs\Applications\Altium\Datasheets\R0603_NIC_NRC.pdf; Author: CERN DEM JLC; CreateDate: 03.12.2007; LatestRevisionDate: 13.03.2008
R67 = R0402_31K6_0.1%_0.063W_25PPM_YAGEO_RT: Resistor - 0.1%; Part Description: Thin Film Chip Resistor; Manufacturer: YAGEO; Manufacturer Part Number: RT0402BRD0731K6L; Power: 0.063W; TC: ±25ppm/°C; Voltage: 50V; PressFit: No; Part Number: R0402_31K6_0.1%_0.063W_25PPM_YAGEO_RT; Component Kind: Standard; Component Type: Standard; Pin Count: 2; Value: 31k6; Status: Not Recommended; Case: 0402; Mounted: Yes; Sense: No; Socket: No; SMD: Yes; ComponentHeight: 0.35mm; HelpURL: \\cern.ch\dfs\Applications\Altium\Datasheets\R0402_YAGEO_RT.pdf; Author: CERN DEM BC; CreateDate: 30.07.2020; LatestRevisionDate: 30.07.2020
R84 = R0402_8K2_1%_0.0625W_100PPM: Resistor - 1%; Part Description: General Purpose Thick Film Chip Resistor; Manufacturer: GENERIC; Manufacturer1 Part Number: 232270678202L; TC: ±100ppm/°C; PressFit: No; Part Number: R0402_8K2_1%_0.0625W_100PPM; Component Kind: Standard; Component Type: Standard; Pin Count: 2; Value: 8k2; Status: Not Recommended; Power: 0.0625W; Tolerance: ±1%; Manufacturer Part Number: R0402_8K2_1%_0.0625W_100PPM; Case: 0402; Mounted: Yes; Sense: No; Socket: No; SMD: Yes; Manufacturer1 Example: YAGEO PHYCOMP; Manufacturer1 ComponentHeight: 0.4mm; HelpURL: \\cern.ch\dfs\Applications\Altium\Datasheets\R0402_Phycomp_RC0402.pdf; Author: CERN DEM JLC; CreateDate: 03.12.2007; LatestRevisionDate: 17.10.2012
R89 = R0402_1K_1%_0.0625W_100PPM: Resistor - 1%; Part Description: General Purpose Thick Film Chip Resistor; Manufacturer: GENERIC; Manufacturer1 Part Number: 232270671002L; TC: ±100ppm/°C; PressFit: No; Part Number: R0402_1K_1%_0.0625W_100PPM; Component Kind: Standard; Component Type: Standard; Pin Count: 2; Value: 1k; Status: Not Recommended; Power: 0.0625W; Tolerance: ±1%; Manufacturer Part Number: R0402_1K_1%_0.0625W_100PPM; Case: 0402; Mounted: Yes; Sense: No; Socket: No; SMD: Yes; Manufacturer1 Example: YAGEO PHYCOMP; Manufacturer1 ComponentHeight: 0.4mm; HelpURL: \\cern.ch\dfs\Applications\Altium\Datasheets\R0402_Phycomp_RC0402.pdf; Author: CERN DEM JLC; CreateDate: 03.12.2007; LatestRevisionDate: 17.10.2012; ClassName: Artix
T4 T5 = BSS138LT1G: N-CHANNEL MOSFET WITH DIODE; Part Description: 50V 200mA N-Channel Enhancement Mode Field-Effect Transistor; Manufacturer: ON SEMICONDUCTOR; PressFit: No; Bonding: No; Part Number: BSS138LT1G; Component Kind: Standard; Component Type: Standard; Device: BSS138LT1G; PackageDescription: SOT23 3-Leads, Pitch 0.95mm - Body 1.4x3mm, IPC Medium Density; Manufacturer Part Number: BSS138LT1G; Pin Count: 3; Case: SOT23-3; Mounted: Yes; Socket: No; SMD: Yes; Sense: No; ComponentHeight: 1.11mm; HelpURL: \\cern.ch\dfs\Applications\Altium\Datasheets\BSS138LT1G.pdf; Author: CERN DEM JLC; CreateDate: 23.03.2009; LatestRevisionDate: 23.03.2009
TP12-TP16 = SMD_PAD_1.27X1.27MM: Part Description: 1.27mm x 1.27mm PCB Copper Area (SMD Test Point); Mounted: No; Part Number: SMD_PAD_1.27X1.27MM; Component Type: Standard (No BOM); Pin Count: 1; Family: Test Point; Socket: No; SMD: Yes; Sense: No; Status: None; ComponentHeight: 0mm; HelpURL: Undefined; Author: CERN DEM JLC; CreateDate: 12.01.2008; LatestRevisionDate: 12.01.2008; PackageDescription: 1.27mm x 1.27mm PCB Copper Area (SMD Test Point)

## Nets that join several sheets
GND: PMT_simulator (C212.2 R119.2 R126.2), DIOT_Connectors_P1_P6 (68 pins), EEM_Connectors (41 pins), LVDS_IFC (37 pins), U_PULSE_TRIGGER (9 pins), DAC (32 pins), U_PULSE_TRIGGER (9 pins), U_PULSE_TRIGGER (9 pins), U_PULSE_TRIGGER (9 pins), U_PULSE_TRIGGER (9 pins), U_PULSE_TRIGGER (9 pins), Supply_DAC (65 pins)
N12V0A: U_PULSE_TRIGGER (C64A.2 IC12A.4), DAC (5 pins), U_PULSE_TRIGGER (C64B.2 IC12B.4), U_PULSE_TRIGGER (C64C.2 IC12C.4), U_PULSE_TRIGGER (C64D.2 IC12D.4), U_PULSE_TRIGGER (C64E.2 IC12E.4), U_PULSE_TRIGGER (C64F.2 IC12F.4), Supply_DAC (11 pins)
P3V3: LVDS_IFC (36 pins), DAC (C81.2 IC29.2 L1.1 R83.2), Supply_DAC (8 pins)
P3V3_DIOT: DIOT_Connectors_P1_P6 (15 pins), Supply_DAC (R74.2)
P3V3_MP: DIOT_Connectors_P1_P6 (D9.1), EEM_Connectors (11 pins)
P12V0: DIOT_Connectors_P1_P6 (10 pins), EEM_Connectors (J8.28 J8.29 J9.28 J9.29), Supply_DAC (C36.1 C37.2 L4.2)
P12V0A: U_PULSE_TRIGGER (C59A.2 IC12A.8), DAC (6 pins), U_PULSE_TRIGGER (C59B.2 IC12B.8), U_PULSE_TRIGGER (C59C.2 IC12C.8), U_PULSE_TRIGGER (C59D.2 IC12D.8), U_PULSE_TRIGGER (C59E.2 IC12E.8), U_PULSE_TRIGGER (C59F.2 IC12F.8), Supply_DAC (8 pins)
BP_I2C.SCL: DIOT_Connectors_P1_P6 (D5.3 J6.B2), EEM_Connectors (IC27.2)
BP_I2C.SDA: DIOT_Connectors_P1_P6 (D5.1 J6.C2), EEM_Connectors (IC27.3)
BP_IO.LVDS_N0: DIOT_Connectors_P1_P6 (J6.E3), EEM_Connectors (R161.1)
BP_IO.LVDS_N1: DIOT_Connectors_P1_P6 (J6.B3), EEM_Connectors (R162.1)
BP_IO.LVDS_N2: DIOT_Connectors_P1_P6 (J6.C4), EEM_Connectors (R163.1)
BP_IO.LVDS_N3: DIOT_Connectors_P1_P6 (J6.L4), EEM_Connectors (R164.1)
BP_IO.LVDS_N4: DIOT_Connectors_P1_P6 (J6.I4), EEM_Connectors (R167.1)
BP_IO.LVDS_N5: DIOT_Connectors_P1_P6 (J6.K5), EEM_Connectors (R168.1)
BP_IO.LVDS_N6: DIOT_Connectors_P1_P6 (J6.H5), EEM_Connectors (R169.1)
BP_IO.LVDS_N7: DIOT_Connectors_P1_P6 (J6.F6), EEM_Connectors (R170.1)
BP_IO.LVDS_N8: DIOT_Connectors_P1_P6 (J6.C6), EEM_Connectors (R171.1)
BP_IO.LVDS_N9: DIOT_Connectors_P1_P6 (J6.L6), EEM_Connectors (R172.1)
BP_IO.LVDS_N10: DIOT_Connectors_P1_P6 (J6.I6), EEM_Connectors (R173.1)
BP_IO.LVDS_N11: DIOT_Connectors_P1_P6 (J7.E1), EEM_Connectors (R174.1)
BP_IO.LVDS_N12: DIOT_Connectors_P1_P6 (J7.B1), EEM_Connectors (R175.1)
BP_IO.LVDS_N13: DIOT_Connectors_P1_P6 (J7.K1), EEM_Connectors (R176.1)
BP_IO.LVDS_N14: DIOT_Connectors_P1_P6 (J7.H1), EEM_Connectors (R177.1)
BP_IO.LVDS_N15: DIOT_Connectors_P1_P6 (J6.F2), EEM_Connectors (R178.1)
BP_IO.LVDS_P0: DIOT_Connectors_P1_P6 (J6.D3), EEM_Connectors (R145.1)
BP_IO.LVDS_P1: DIOT_Connectors_P1_P6 (J6.A3), EEM_Connectors (R146.1)
BP_IO.LVDS_P2: DIOT_Connectors_P1_P6 (J6.B4), EEM_Connectors (R147.1)
BP_IO.LVDS_P3: DIOT_Connectors_P1_P6 (J6.K4), EEM_Connectors (R148.1)
BP_IO.LVDS_P4: DIOT_Connectors_P1_P6 (J6.H4), EEM_Connectors (R149.1)
BP_IO.LVDS_P5: DIOT_Connectors_P1_P6 (J6.J5), EEM_Connectors (R150.1)
BP_IO.LVDS_P6: DIOT_Connectors_P1_P6 (J6.G5), EEM_Connectors (R151.1)
BP_IO.LVDS_P7: DIOT_Connectors_P1_P6 (J6.E6), EEM_Connectors (R152.1)
BP_IO.LVDS_P8: DIOT_Connectors_P1_P6 (J6.B6), EEM_Connectors (R153.1)
BP_IO.LVDS_P9: DIOT_Connectors_P1_P6 (J6.K6), EEM_Connectors (R154.1)
BP_IO.LVDS_P10: DIOT_Connectors_P1_P6 (J6.H6), EEM_Connectors (R155.1)
BP_IO.LVDS_P11: DIOT_Connectors_P1_P6 (J7.D1), EEM_Connectors (R156.1)
BP_IO.LVDS_P12: DIOT_Connectors_P1_P6 (J7.A1), EEM_Connectors (R157.1)
BP_IO.LVDS_P13: DIOT_Connectors_P1_P6 (J7.J1), EEM_Connectors (R158.1)
BP_IO.LVDS_P14: DIOT_Connectors_P1_P6 (J7.G1), EEM_Connectors (R159.1)
BP_IO.LVDS_P15: DIOT_Connectors_P1_P6 (J6.E2), EEM_Connectors (R160.1)
CSn: LVDS_IFC (R9.1), DAC (IC1.45 TP4.1)
LVDS_N0: EEM_Connectors (J8.3 R161.2), LVDS_IFC (IC3.4 R6.2)
LVDS_N1: EEM_Connectors (J8.6 R162.2), LVDS_IFC (IC3.1 R4.1)
LVDS_N2: EEM_Connectors (J8.9 R163.2), LVDS_IFC (IC5.7)
LVDS_N3: EEM_Connectors (J8.12 R164.2), LVDS_IFC (IC4.1 R8.1)
LVDS_N4: EEM_Connectors (J8.15 R167.2), LVDS_IFC (IC6.1 R11.1)
LVDS_N5: EEM_Connectors (J8.18 R168.2), LVDS_IFC (IC6.4 R13.2)
LVDS_N6: EEM_Connectors (J8.21 R169.2), LVDS_IFC (IC7.1 R15.1)
LVDS_N7: EEM_Connectors (J8.24 R170.2), LVDS_IFC (IC7.4 R17.2)
LVDS_N8: EEM_Connectors (J9.3 R171.2), LVDS_IFC (IC8.1 R19.1)
LVDS_N9: EEM_Connectors (J9.6 R172.2), LVDS_IFC (IC8.4 R21.2)
LVDS_N10: EEM_Connectors (J9.9 R173.2), LVDS_IFC (IC9.1 R23.1)
LVDS_N11: EEM_Connectors (J9.12 R174.2), LVDS_IFC (IC9.4 R25.2)
LVDS_N12: EEM_Connectors (J9.15 R175.2), LVDS_IFC (IC10.1 R27.1)
LVDS_N13: EEM_Connectors (J9.18 R176.2), LVDS_IFC (IC10.4 R29.2)
LVDS_N14: EEM_Connectors (J9.21 R177.2), LVDS_IFC (IC11.1 R31.1)
LVDS_N15: EEM_Connectors (J9.24 R178.2), LVDS_IFC (IC11.4 R33.2)
LVDS_P0: EEM_Connectors (J8.2 R145.2), LVDS_IFC (IC3.3 R6.1)
LVDS_P1: EEM_Connectors (J8.5 R146.2), LVDS_IFC (IC3.2 R4.2)
LVDS_P2: EEM_Connectors (J8.8 R147.2), LVDS_IFC (IC5.8)
LVDS_P3: EEM_Connectors (J8.11 R148.2), LVDS_IFC (IC4.2 R8.2)
LVDS_P4: EEM_Connectors (J8.14 R149.2), LVDS_IFC (IC6.2 R11.2)
LVDS_P5: EEM_Connectors (J8.17 R150.2), LVDS_IFC (IC6.3 R13.1)
LVDS_P6: EEM_Connectors (J8.20 R151.2), LVDS_IFC (IC7.2 R15.2)
LVDS_P7: EEM_Connectors (J8.23 R152.2), LVDS_IFC (IC7.3 R17.1)
LVDS_P8: EEM_Connectors (J9.2 R153.2), LVDS_IFC (IC8.2 R19.2)
LVDS_P9: EEM_Connectors (J9.5 R154.2), LVDS_IFC (IC8.3 R21.1)
LVDS_P10: EEM_Connectors (J9.8 R155.2), LVDS_IFC (IC9.2 R23.2)
LVDS_P11: EEM_Connectors (J9.11 R156.2), LVDS_IFC (IC9.3 R25.1)
LVDS_P12: EEM_Connectors (J9.14 R157.2), LVDS_IFC (IC10.2 R27.2)
LVDS_P13: EEM_Connectors (J9.17 R158.2), LVDS_IFC (IC10.3 R29.1)
LVDS_P14: EEM_Connectors (J9.20 R159.2), LVDS_IFC (IC11.2 R31.2)
LVDS_P15: EEM_Connectors (J9.23 R160.2), LVDS_IFC (IC11.3 R33.1)
LVTTL4: LVDS_IFC (R12.1), U_PULSE_TRIGGER (T2A.1)
LVTTL5: LVDS_IFC (R14.1), U_PULSE_TRIGGER (T1A.1)
LVTTL6: LVDS_IFC (R16.1), U_PULSE_TRIGGER (T2B.1)
LVTTL7: LVDS_IFC (R18.1), U_PULSE_TRIGGER (T1B.1)
LVTTL8: LVDS_IFC (R20.1), U_PULSE_TRIGGER (T2C.1)
LVTTL9: LVDS_IFC (R22.1), U_PULSE_TRIGGER (T1C.1)
LVTTL10: LVDS_IFC (R24.1), U_PULSE_TRIGGER (T2D.1)
LVTTL11: LVDS_IFC (R26.1), U_PULSE_TRIGGER (T1D.1)
LVTTL12: LVDS_IFC (R28.1), U_PULSE_TRIGGER (T2E.1)
LVTTL13: LVDS_IFC (R30.1), U_PULSE_TRIGGER (T1E.1)
LVTTL14: LVDS_IFC (R32.1), U_PULSE_TRIGGER (T2F.1)
LVTTL15: LVDS_IFC (R34.1), U_PULSE_TRIGGER (T1F.1)
NetIC22_5: DIOT_Connectors_P1_P6 (R70.2), EEM_Connectors (R75.2 R78.2), Supply_DAC (IC22.5)
PGOOD: DIOT_Connectors_P1_P6 (R87.1 T6.1), Supply_DAC (T4.3)
SCKI: LVDS_IFC (R7.1), DAC (IC1.46 R1.2 TP1.1)
SDI: LVDS_IFC (R5.1), DAC (IC1.47 R2.2 TP2.1)
SDO: LVDS_IFC (R10.1), DAC (IC1.49 TP3.1)
SERVMOD: DIOT_Connectors_P1_P6 (R86.2 R129.2 R138.1), EEM_Connectors (IC27.5 IC27.13)
VOUT1: U_PULSE_TRIGGER (IC12A.5), DAC (IC1.34)
VOUT2: U_PULSE_TRIGGER (IC12A.3), DAC (IC1.35)
VOUT3: DAC (IC1.36), U_PULSE_TRIGGER (IC12B.5)
VOUT4: DAC (IC1.37), U_PULSE_TRIGGER (IC12B.3)
VOUT5: DAC (IC1.39), U_PULSE_TRIGGER (IC12C.5)
VOUT6: DAC (IC1.40), U_PULSE_TRIGGER (IC12C.3)
VOUT7: DAC (IC1.41), U_PULSE_TRIGGER (IC12D.5)
VOUT8: DAC (IC1.42), U_PULSE_TRIGGER (IC12D.3)
VOUT9: DAC (IC1.15), U_PULSE_TRIGGER (IC12E.5)
VOUT10: DAC (IC1.16), U_PULSE_TRIGGER (IC12E.3)
VOUT11: DAC (IC1.17), U_PULSE_TRIGGER (IC12F.5)
VOUT12: DAC (IC1.18), U_PULSE_TRIGGER (IC12F.3)

## Assembly variants
DIOT: not fitted C56 C82 C212 D11 D12 IC14 IC18 IC30 IC37 IC38 J8 J9 R39 R44 R47 R49 R53 R126
EEM: not fitted C56 C60 C65 C74 C75 C76 C77 C78 C79 C82 D9 IC14 IC18 IC19 IC23 IC24 IC27 IC30 R39 R44 R47 R48 R53 R54 R64 R66 R69 R70 R71 R72 R73 R74 R119 R120 R145 R146 R147 R148 R149 R150 R151 R152 R153 R154 R155 R156 R157 R158 R159 R160 R161 R162 R163 R164 R167 R168 R169 R170 R171 R172 R173 R174 R175 R176 R177 R178 T3